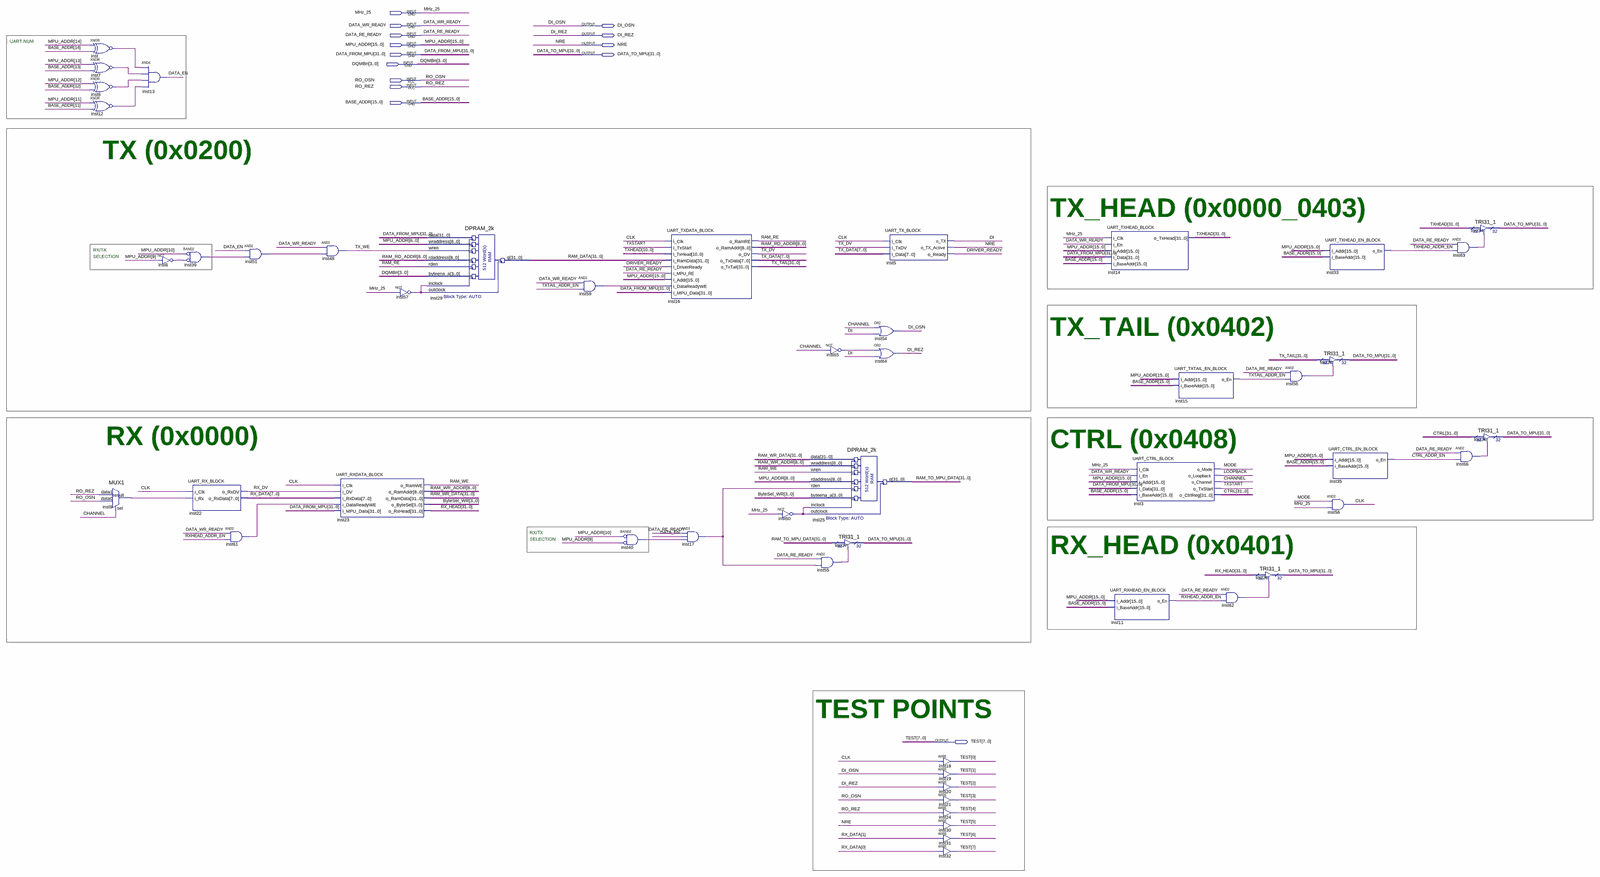
[diagram p0: schematic sheet, whole]
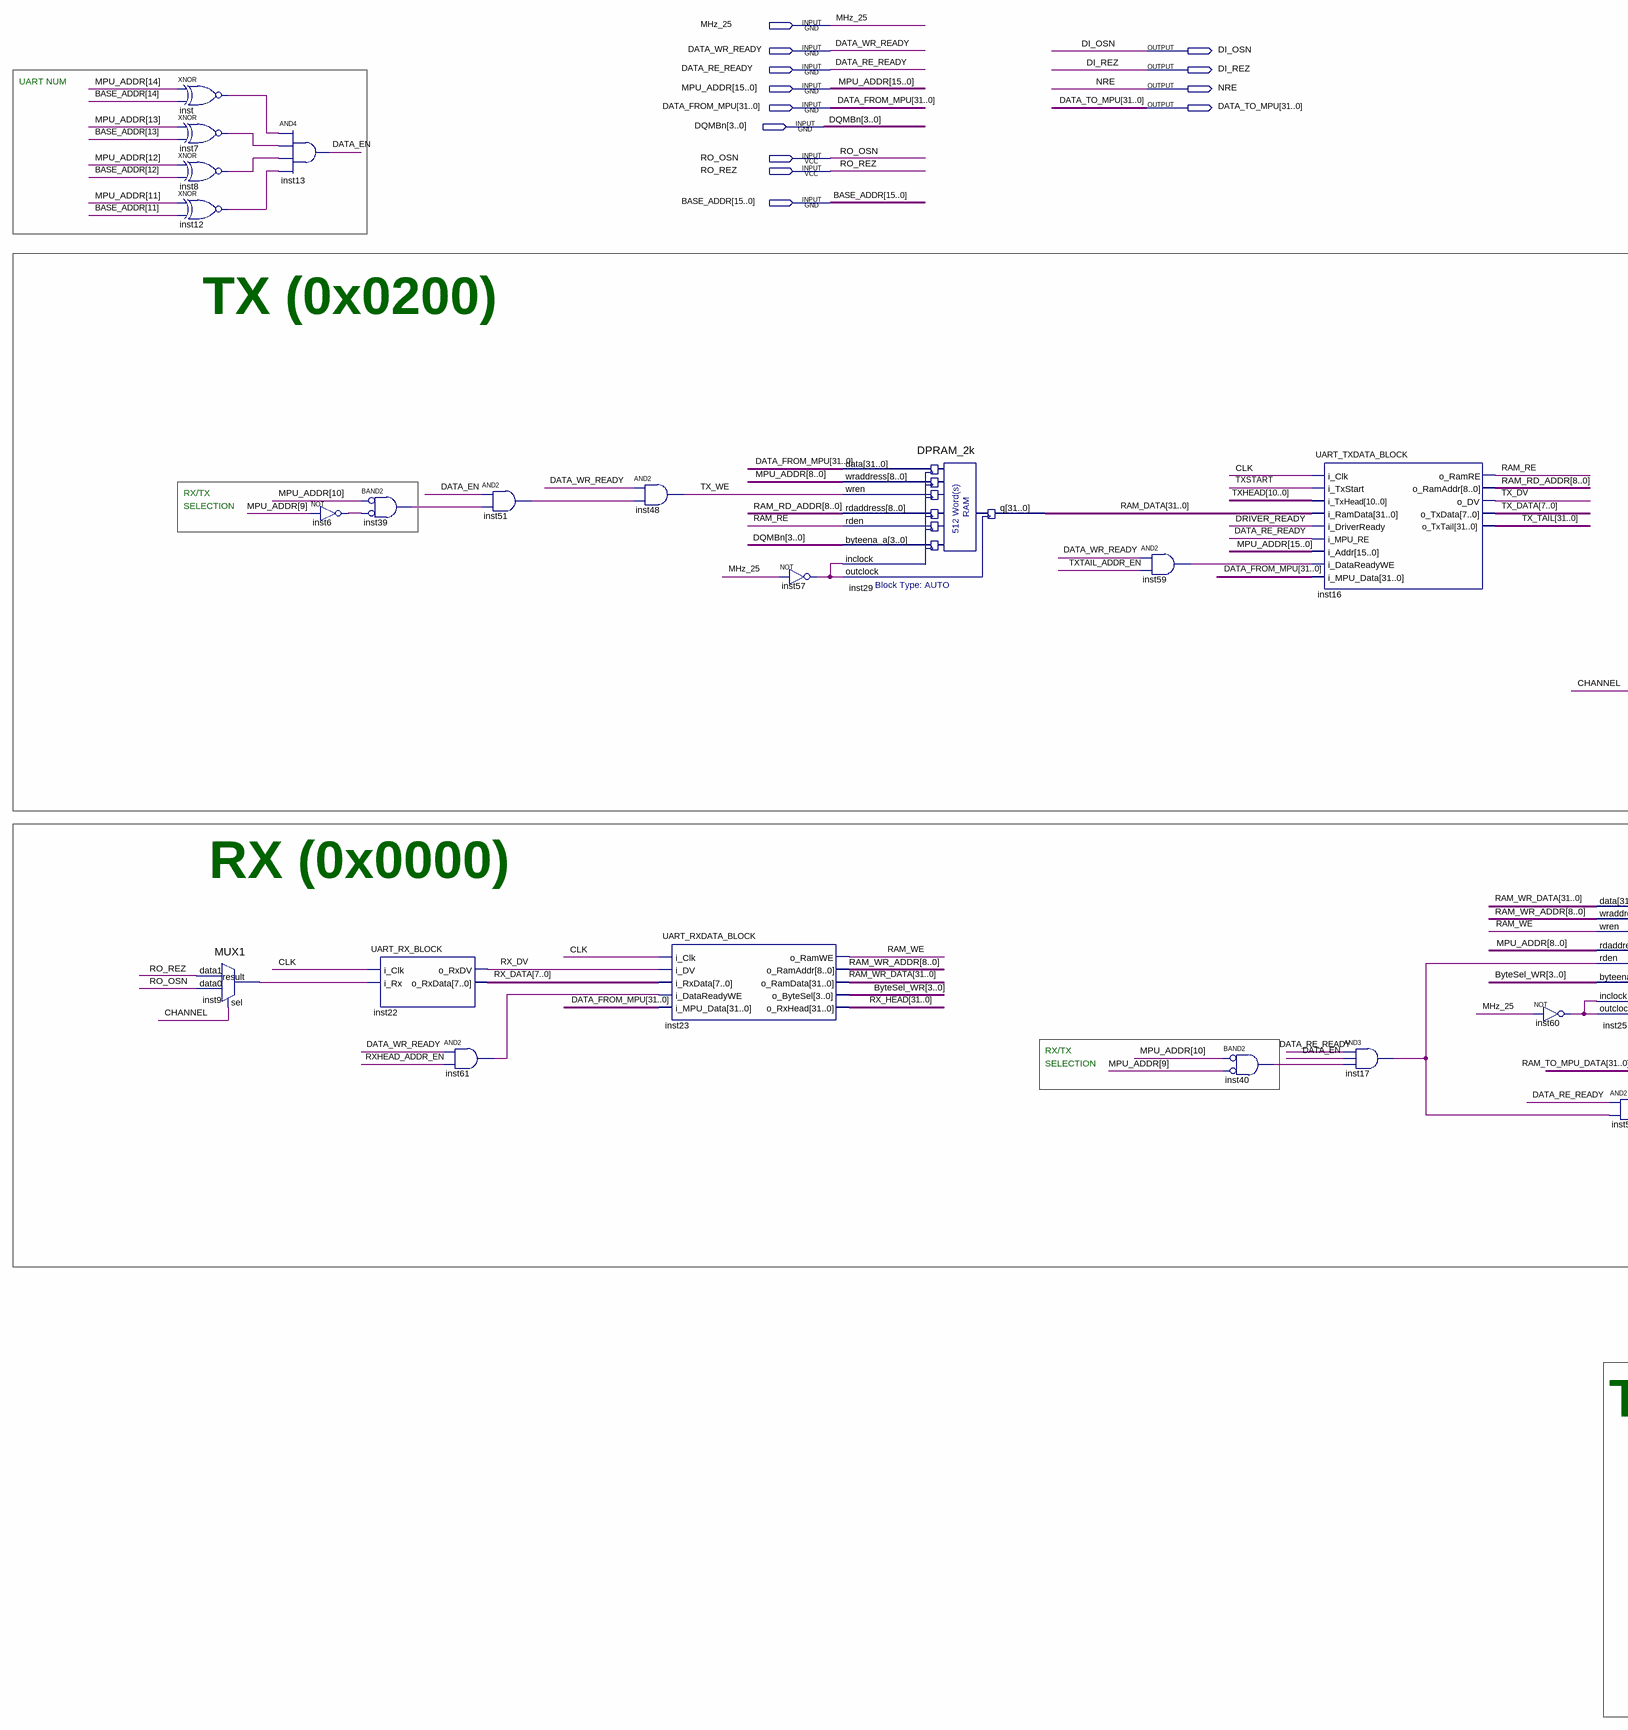
[diagram p1: schematic sheet, left part]
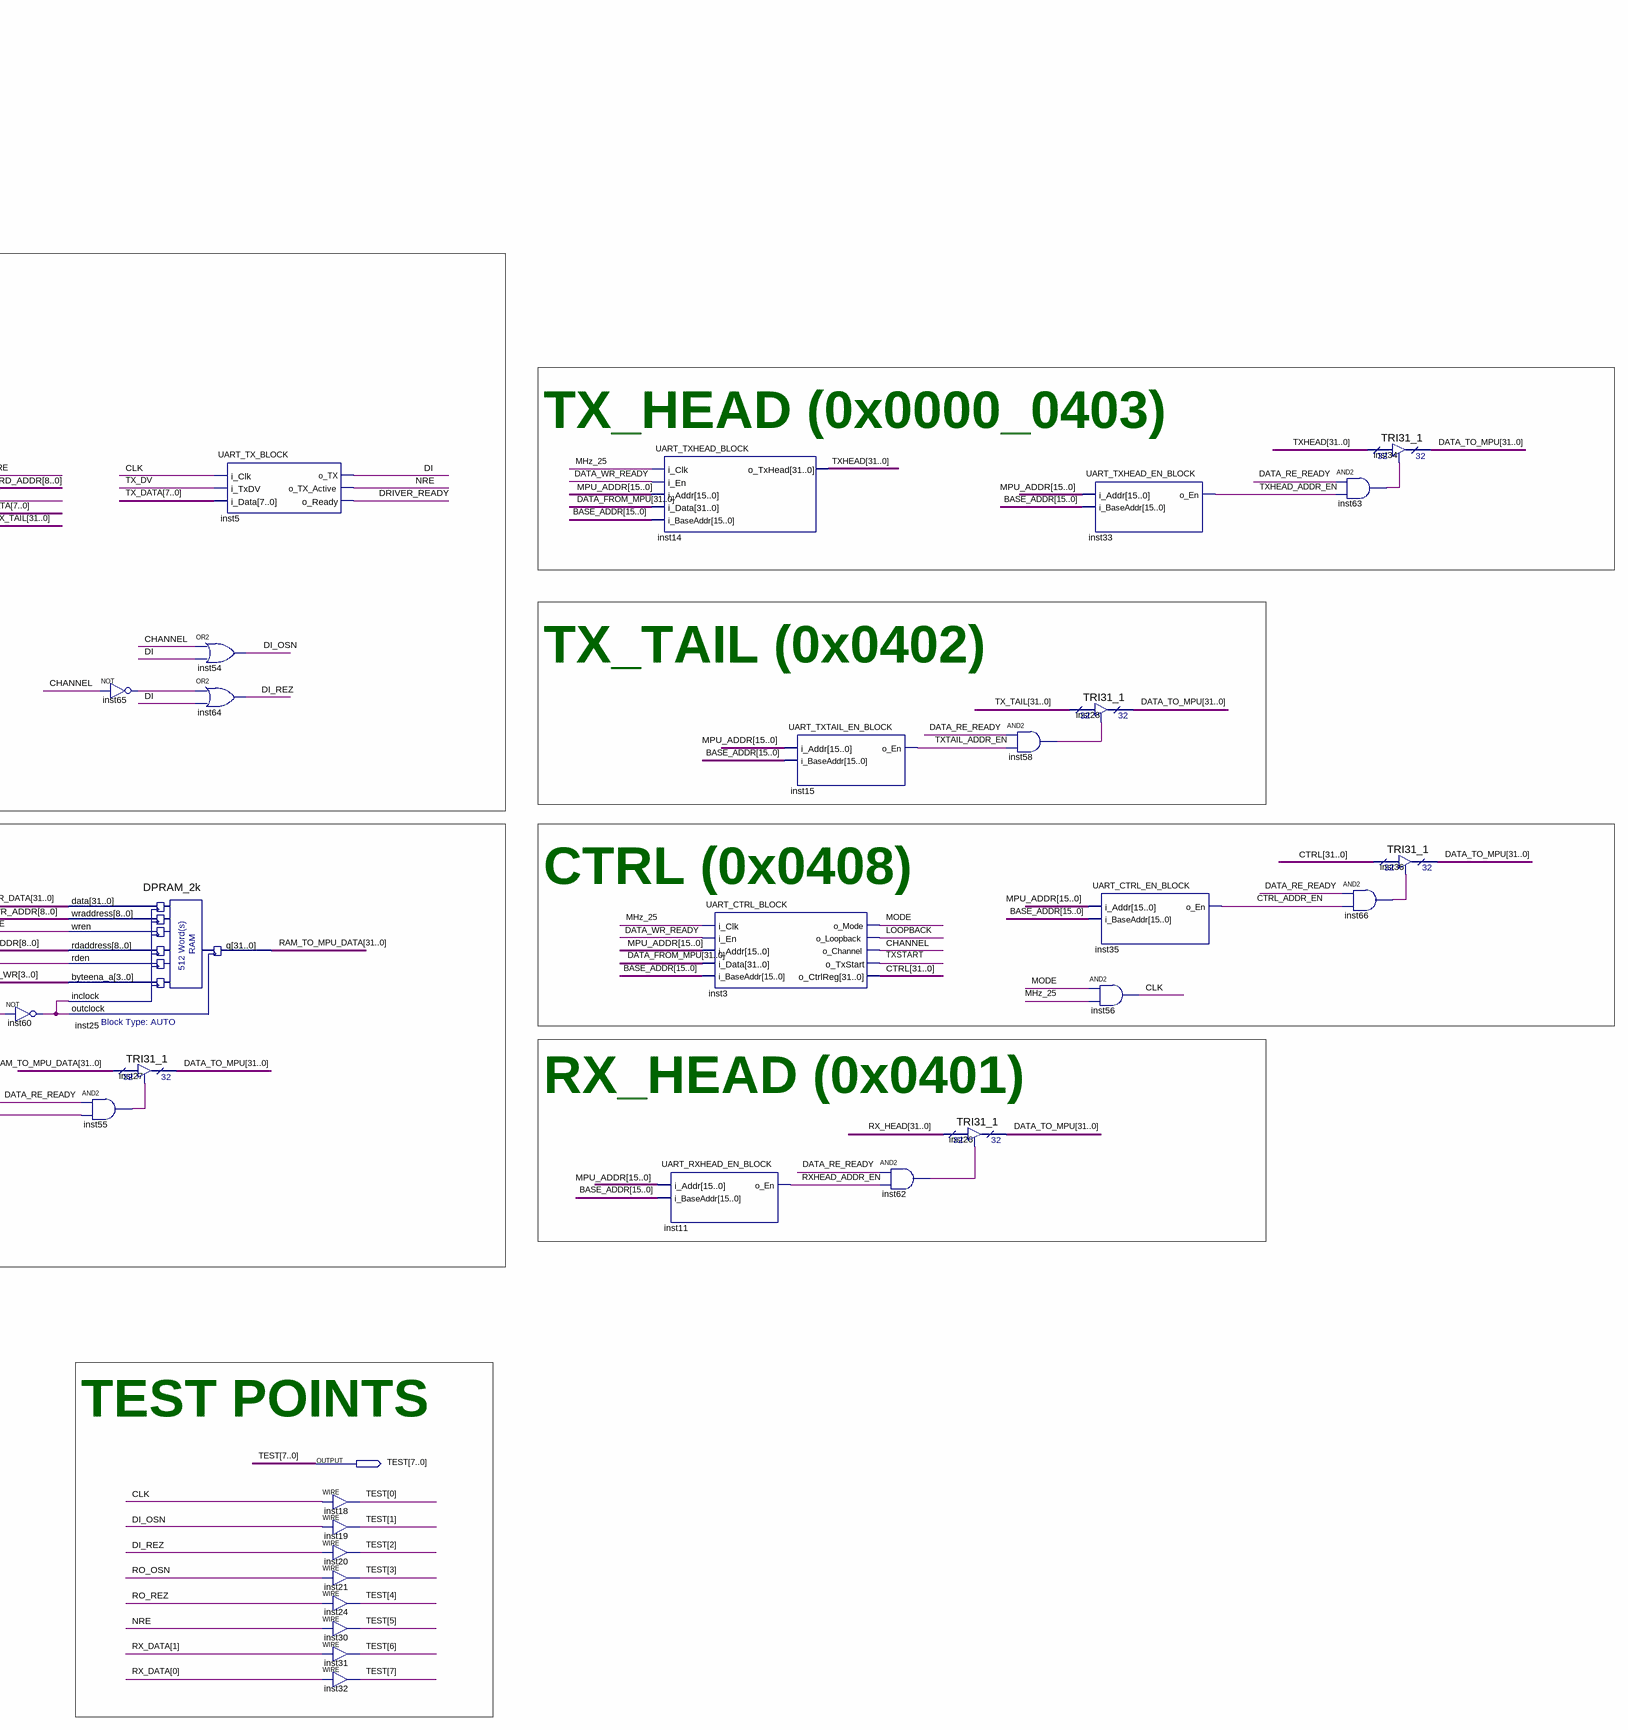
[diagram p2: schematic sheet, right part]
// Quartus schematic UART_MODULE.bdf as structural Verilog: 50 symbols, 14 pins
module UART_MODULE (
  input  MHz_25,
  input  DATA_WR_READY,
  input  DATA_RE_READY,
  input  [15:0] MPU_ADDR,
  input  [31:0] DATA_FROM_MPU,
  input  [3:0] DQMBn,
  input  RO_OSN,
  input  RO_REZ,
  input  [15:0] BASE_ADDR,
  output DI_OSN,
  output DI_REZ,
  output NRE,
  output [31:0] DATA_TO_MPU,
  output [7:0] TEST
);

  wire CHANNEL, CLK, CTRL_ADDR_EN, DATA_EN, DI, DRIVER_READY, inst6_out, inst7_out, inst8_out, inst9_result,
       inst12_out, inst17_out, inst39_out, inst40_out, inst51_out, inst55_out, inst57_out, inst58_out,
       inst59_out, inst60_out, inst61_out, inst62_out, inst63_out, inst65_out, inst66_out, inst_out,
       LOOPBACK, MODE, RAM_RE, RAM_WE, RX_DV, RXHEAD_ADDR_EN, TX_DV, TX_WE, TXHEAD_ADDR_EN, TXSTART,
       TXTAIL_ADDR_EN;
  wire [3:0] ByteSel_WR;
  wire [7:0] RX_DATA, TX_DATA;
  wire [8:0] RAM_RD_ADDR, RAM_WR_ADDR;
  wire [31:0] CTRL, RAM_DATA, RAM_TO_MPU_DATA, RAM_WR_DATA, RX_HEAD, TX_TAIL, TXHEAD;

  xnor inst (inst_out, MPU_ADDR[14], BASE_ADDR[14]);
  xnor inst7 (inst7_out, MPU_ADDR[13], BASE_ADDR[13]);
  xnor inst8 (inst8_out, MPU_ADDR[12], BASE_ADDR[12]);
  xnor inst12 (inst12_out, MPU_ADDR[11], BASE_ADDR[11]);
  MUX1 inst9 (.data1(RO_REZ), .data0(RO_OSN), .sel(CHANNEL), .result(inst9_result));
  and inst13 (DATA_EN, inst_out, inst7_out, inst8_out, inst12_out);
  not inst6 (inst6_out, MPU_ADDR[9]);
  and inst39 (inst39_out, ~MPU_ADDR[10], ~inst6_out);  // BAND2
  UART_RX_BLOCK inst22 (.i_Clk(CLK), .i_Rx(inst9_result), .o_RxDV(RX_DV), .o_RxData(RX_DATA));
  and inst61 (inst61_out, DATA_WR_READY, RXHEAD_ADDR_EN);
  and inst51 (inst51_out, DATA_EN, inst39_out);
  and inst48 (TX_WE, DATA_WR_READY, inst51_out);
  UART_RXDATA_BLOCK inst23 (
    .i_Clk(CLK), .i_DV(RX_DV), .i_RxData(RX_DATA), .i_DataReadyWE(inst61_out), .i_MPU_Data(DATA_FROM_MPU),
    .o_RamWE(RAM_WE), .o_RamAddr(RAM_WR_ADDR), .o_RamData(RAM_WR_DATA), .o_ByteSel(ByteSel_WR),
    .o_RxHead(RX_HEAD));
  not inst57 (inst57_out, MHz_25);
  DPRAM_2k inst29 (
    .data(DATA_FROM_MPU), .wraddress(MPU_ADDR[8:0]), .wren(TX_WE), .rdaddress(RAM_RD_ADDR), .rden(RAM_RE),
    .byteena_a(DQMBn), .inclock(inst57_out), .outclock(inst57_out), .q(RAM_DATA));
  and inst59 (inst59_out, DATA_WR_READY, TXTAIL_ADDR_EN);
  and inst40 (inst40_out, ~MPU_ADDR[10], ~MPU_ADDR[9]);  // BAND2
  UART_TXDATA_BLOCK inst16 (
    .i_Clk(CLK), .i_TxStart(TXSTART), .i_TxHead(TXHEAD[10:0]), .i_RamData(RAM_DATA),
    .i_DriverReady(DRIVER_READY), .i_MPU_RE(DATA_RE_READY), .i_Addr(MPU_ADDR), .i_DataReadyWE(inst59_out),
    .i_MPU_Data(DATA_FROM_MPU), .o_RamRE(RAM_RE), .o_RamAddr(RAM_RD_ADDR), .o_DV(TX_DV), .o_TxData(TX_DATA),
    .o_TxTail(TX_TAIL));
  and inst17 (inst17_out, DATA_RE_READY, DATA_EN, inst40_out);
  not inst60 (inst60_out, MHz_25);
  not inst65 (inst65_out, CHANNEL);
  DPRAM_2k inst25 (
    .data(RAM_WR_DATA), .wraddress(RAM_WR_ADDR), .wren(RAM_WE), .rdaddress(MPU_ADDR[8:0]), .rden(inst17_out),
    .byteena_a(ByteSel_WR), .inclock(inst60_out), .outclock(inst60_out), .q(RAM_TO_MPU_DATA));
  and inst55 (inst55_out, DATA_RE_READY, inst17_out);
  TRI31_1 inst27 (.enabledt(inst55_out), .data(RAM_TO_MPU_DATA), .tridata(DATA_TO_MPU));
  or inst54 (DI_OSN, CHANNEL, DI);
  or inst64 (DI_REZ, inst65_out, DI);
  UART_TX_BLOCK inst5 (
    .i_Clk(CLK), .i_TxDV(TX_DV), .i_Data(TX_DATA), .o_TX(DI), .o_TX_Active(NRE), .o_Ready(DRIVER_READY));
  assign TEST[0] = CLK;  // WIRE inst18
  assign TEST[1] = DI_OSN;  // WIRE inst19
  assign TEST[2] = DI_REZ;  // WIRE inst20
  assign TEST[3] = RO_OSN;  // WIRE inst21
  assign TEST[4] = RO_REZ;  // WIRE inst24
  assign TEST[5] = NRE;  // WIRE inst30
  assign TEST[6] = RX_DATA[1];  // WIRE inst31
  assign TEST[7] = RX_DATA[0];  // WIRE inst32
  UART_TXHEAD_BLOCK inst14 (
    .i_Clk(MHz_25), .i_En(DATA_WR_READY), .i_Addr(MPU_ADDR), .i_Data(DATA_FROM_MPU), .i_BaseAddr(BASE_ADDR),
    .o_TxHead(TXHEAD));
  UART_RXHEAD_EN_BLOCK inst11 (.i_Addr(MPU_ADDR), .i_BaseAddr(BASE_ADDR), .o_En(RXHEAD_ADDR_EN));
  UART_CTRL_BLOCK inst3 (
    .i_Clk(MHz_25), .i_En(DATA_WR_READY), .i_Addr(MPU_ADDR), .i_Data(DATA_FROM_MPU), .i_BaseAddr(BASE_ADDR),
    .o_Mode(MODE), .o_Loopback(LOOPBACK), .o_Channel(CHANNEL), .o_TxStart(TXSTART), .o_CtrlReg(CTRL));
  UART_TXTAIL_EN_BLOCK inst15 (.i_Addr(MPU_ADDR), .i_BaseAddr(BASE_ADDR), .o_En(TXTAIL_ADDR_EN));
  and inst62 (inst62_out, DATA_RE_READY, RXHEAD_ADDR_EN);
  TRI31_1 inst26 (.enabledt(inst62_out), .data(RX_HEAD), .tridata(DATA_TO_MPU));
  and inst58 (inst58_out, DATA_RE_READY, TXTAIL_ADDR_EN);
  TRI31_1 inst28 (.enabledt(inst58_out), .data(TX_TAIL), .tridata(DATA_TO_MPU));
  UART_TXHEAD_EN_BLOCK inst33 (.i_Addr(MPU_ADDR), .i_BaseAddr(BASE_ADDR), .o_En(TXHEAD_ADDR_EN));
  UART_CTRL_EN_BLOCK inst35 (.i_Addr(MPU_ADDR), .i_BaseAddr(BASE_ADDR), .o_En(CTRL_ADDR_EN));
  and inst56 (CLK, MODE, MHz_25);
  TRI31_1 inst34 (.enabledt(inst63_out), .data(TXHEAD), .tridata(DATA_TO_MPU));
  and inst63 (inst63_out, DATA_RE_READY, TXHEAD_ADDR_EN);
  TRI31_1 inst36 (.enabledt(inst66_out), .data(CTRL), .tridata(DATA_TO_MPU));
  and inst66 (inst66_out, DATA_RE_READY, CTRL_ADDR_EN);

  // Notes on the sheet:
  //   UART NUM
  //   TX (0x0200)
  //   TX_HEAD (0x0000_0403)
  //   RX/TX
  //   SELECTION
  //   TX_TAIL (0x0402)
  //   RX (0x0000)
  //   CTRL (0x0408)
  //   RX/TX
  //   RX_HEAD (0x0401)
  //   SELECTION
  //   TEST POINTS
endmodule
